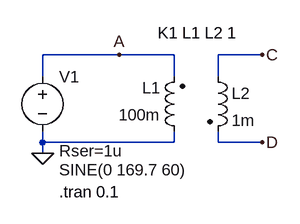
[diagram p0: schematic basicTransformer.asc]
basicTransformer.asc, the LTspice schematic file:
Version 4
SHEET 1 880 680
WIRE 112 80 0 80
WIRE 192 80 112 80
WIRE 320 80 256 80
WIRE 0 112 0 80
WIRE 192 112 192 80
WIRE 256 112 256 80
WIRE 0 208 0 192
WIRE 192 208 192 192
WIRE 192 208 0 208
WIRE 256 208 256 192
WIRE 320 208 256 208
WIRE 0 224 0 208
FLAG 0 224 0
FLAG 320 80 C
FLAG 320 208 D
FLAG 112 80 A
SYMBOL ind2 208 208 R180
WINDOW 0 36 80 Left 2
WINDOW 3 36 40 Left 2
SYMATTR InstName L1
SYMATTR Value 100m
SYMATTR Type ind
SYMBOL ind2 240 96 R0
SYMATTR InstName L2
SYMATTR Value 1m
SYMATTR Type ind
SYMBOL voltage 0 96 R0
WINDOW 3 24 152 Left 2
WINDOW 123 0 0 Left 0
WINDOW 39 24 124 Left 2
SYMATTR InstName V1
SYMATTR Value SINE(0 169.7 60)
SYMATTR SpiceLine Rser=1u
TEXT 168 48 Left 2 !K1 L1 L2 1
TEXT 24 280 Left 2 !.tran 0.1

The netlist it stands for:
* basicTransformer.asc
L1 0 A 100m
L2 C D 1m
V1 A 0 SINE(0 169.7 60) Rser=1u
K1 L1 L2 1
.tran 0.1
.backanno
.end